# EasyEDA schematic schematic_main_board.json

## Sheets
1 Power supply: TITLE: Power supply; REV: 6.1; Date: 2026-03-01; Sheet: 1/5; Drawn By: Jibril Sharafi; Company: EnergyMe SRL
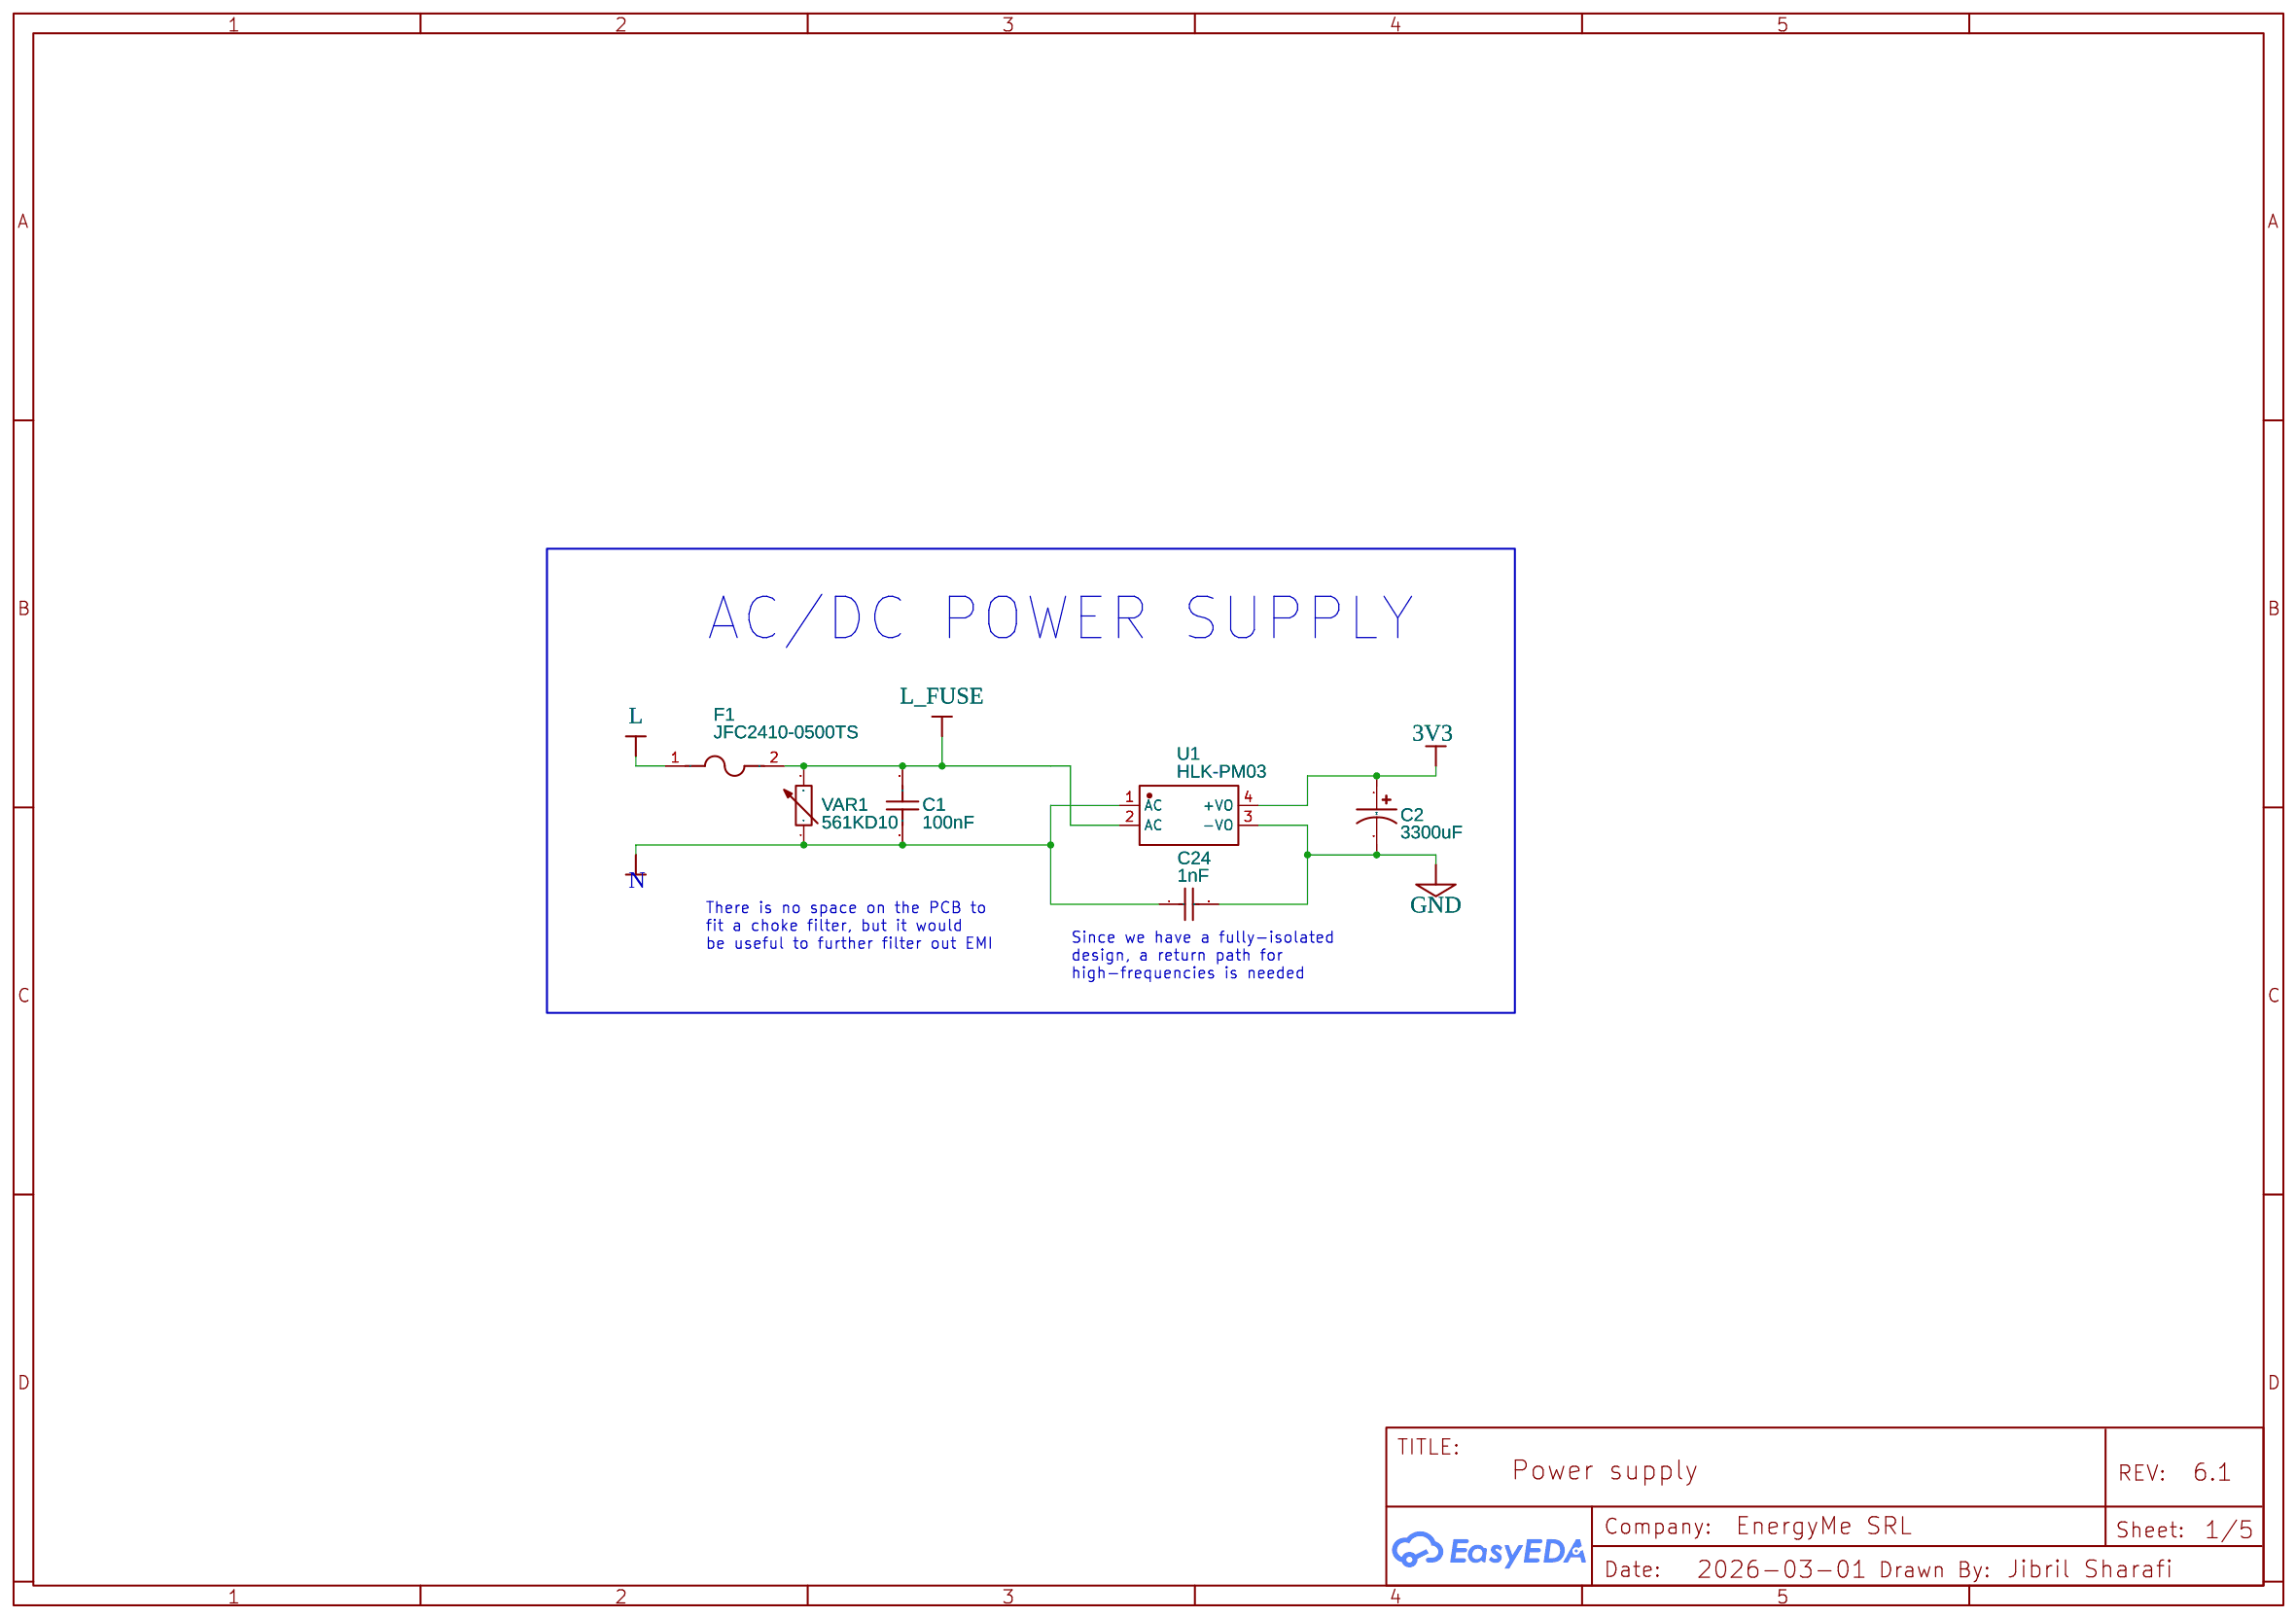
[diagram p0: Power supply]
2 MCU/Multiplexer: TITLE: MCU/Multiplexer; Sheet: 2/5
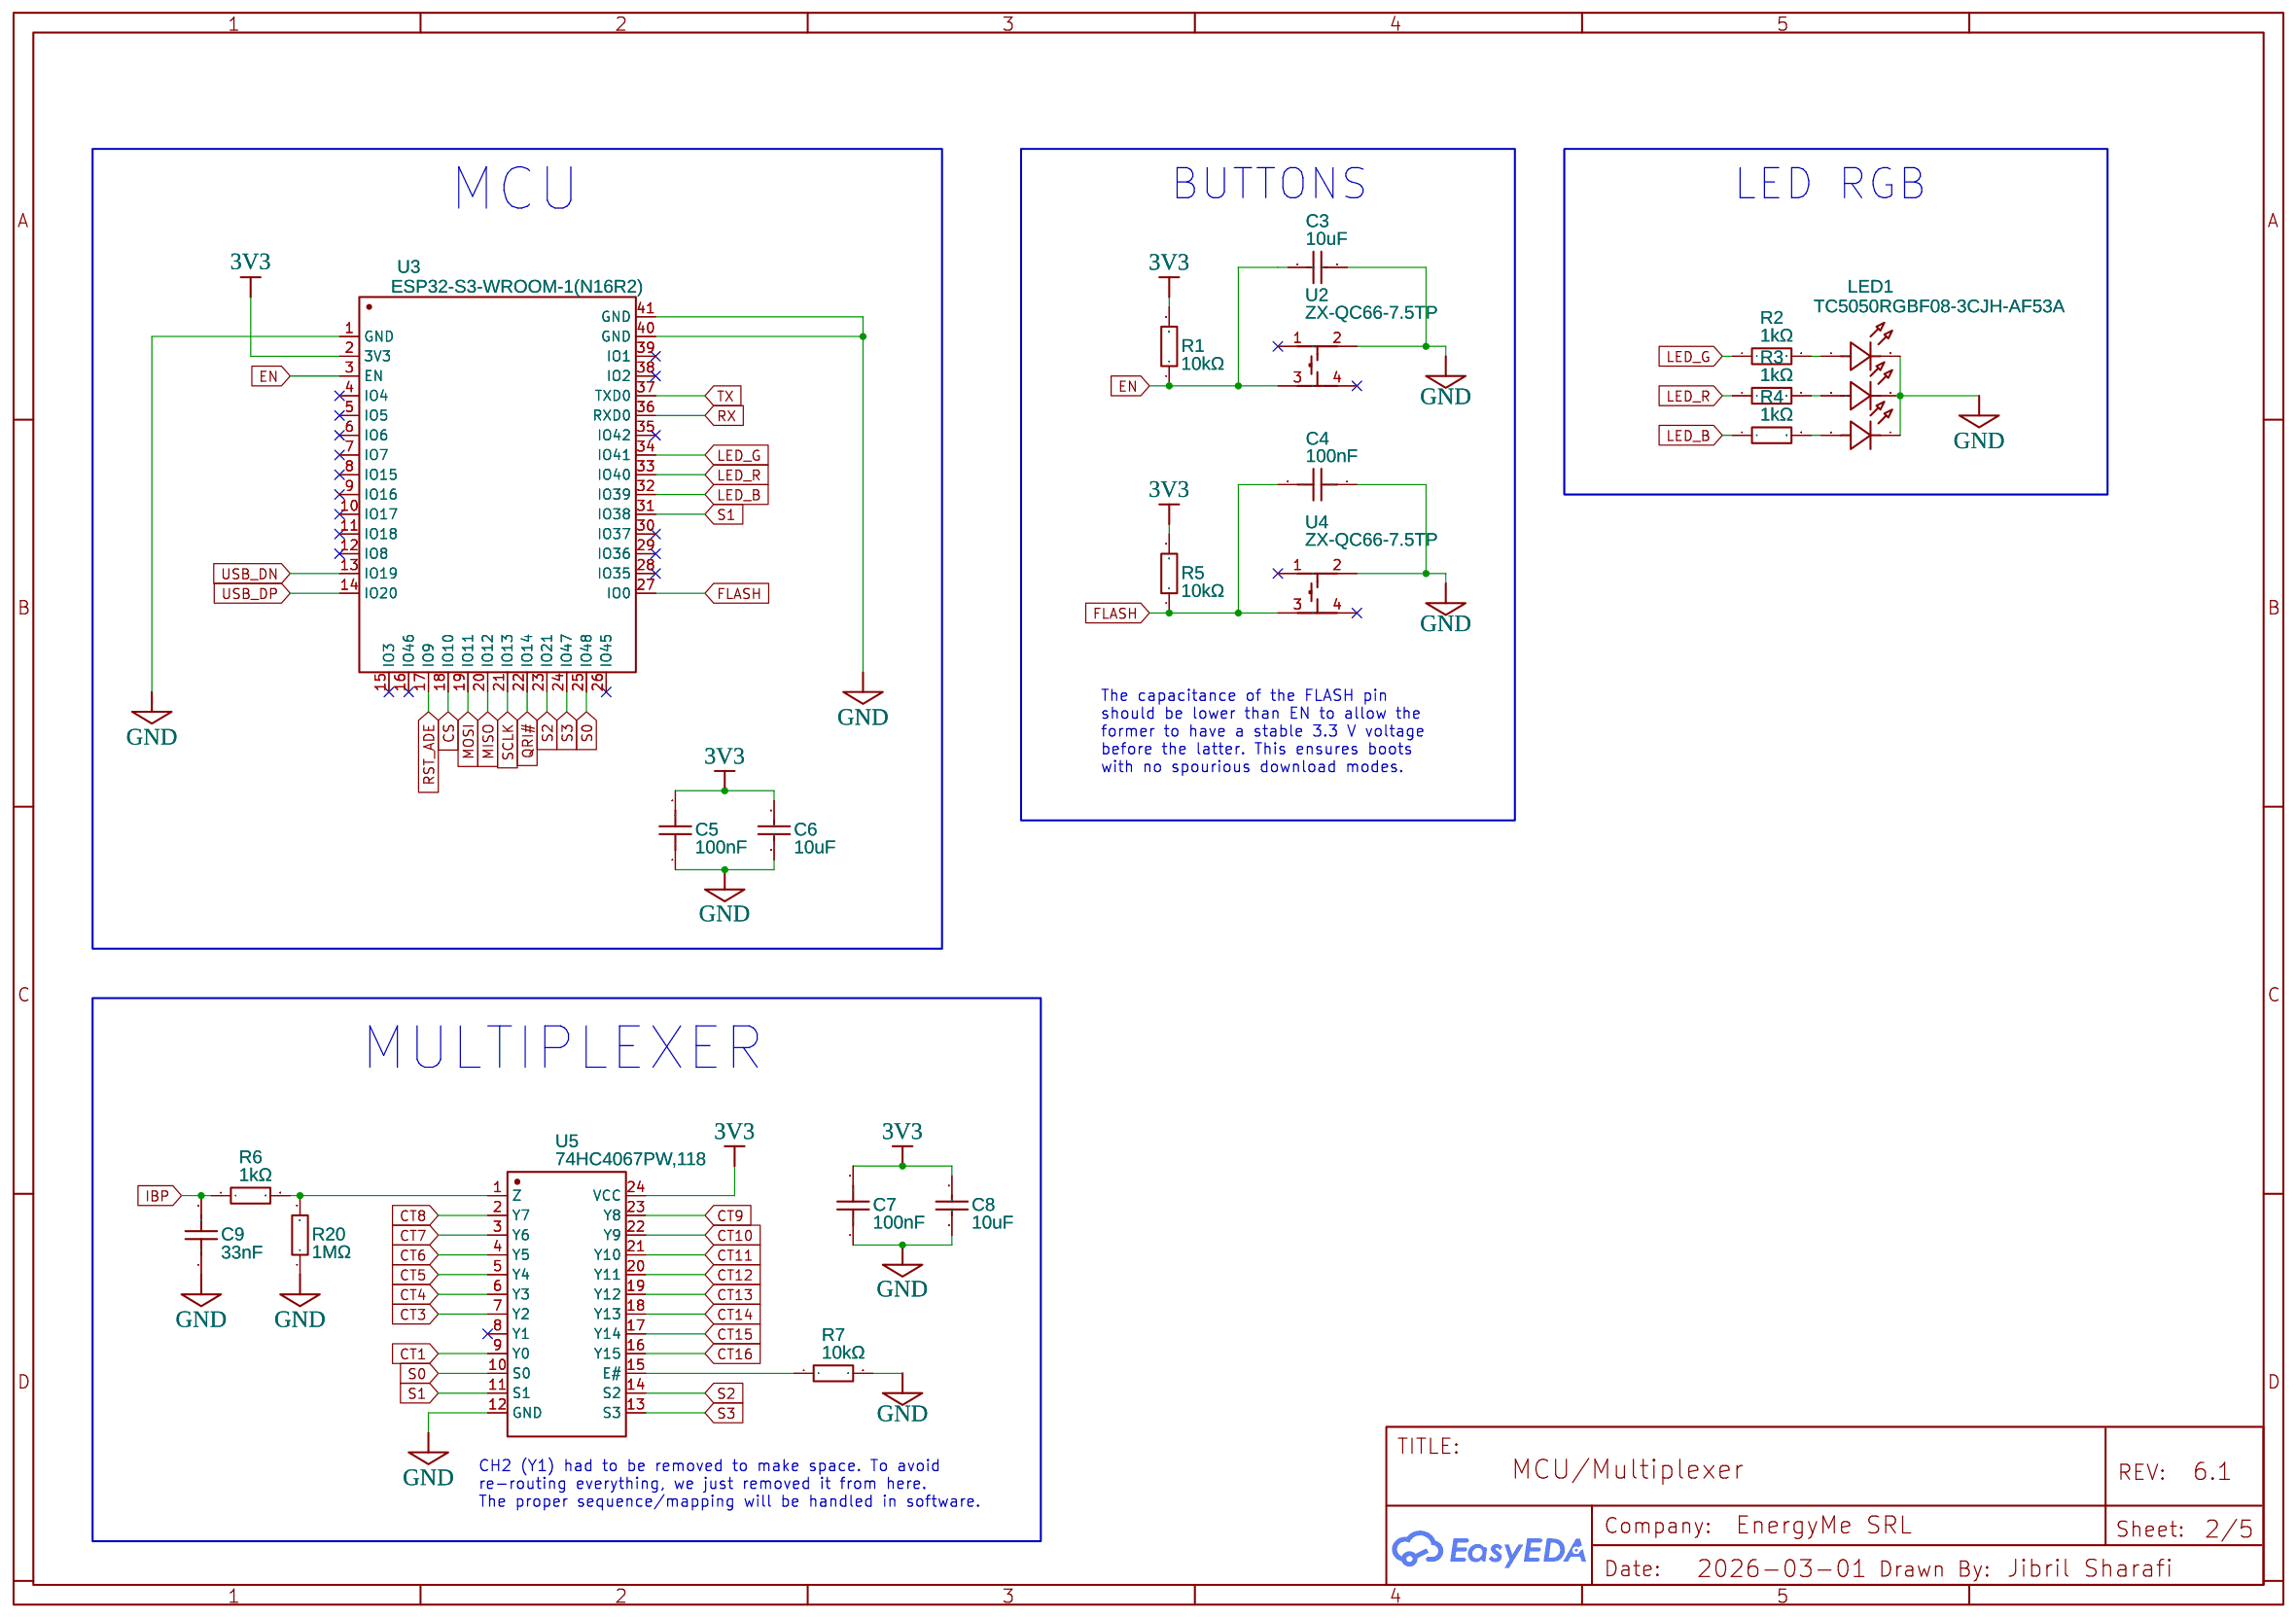
[diagram p1: MCU/Multiplexer]
3 Terminals: TITLE: Terminals; Sheet: 3/5
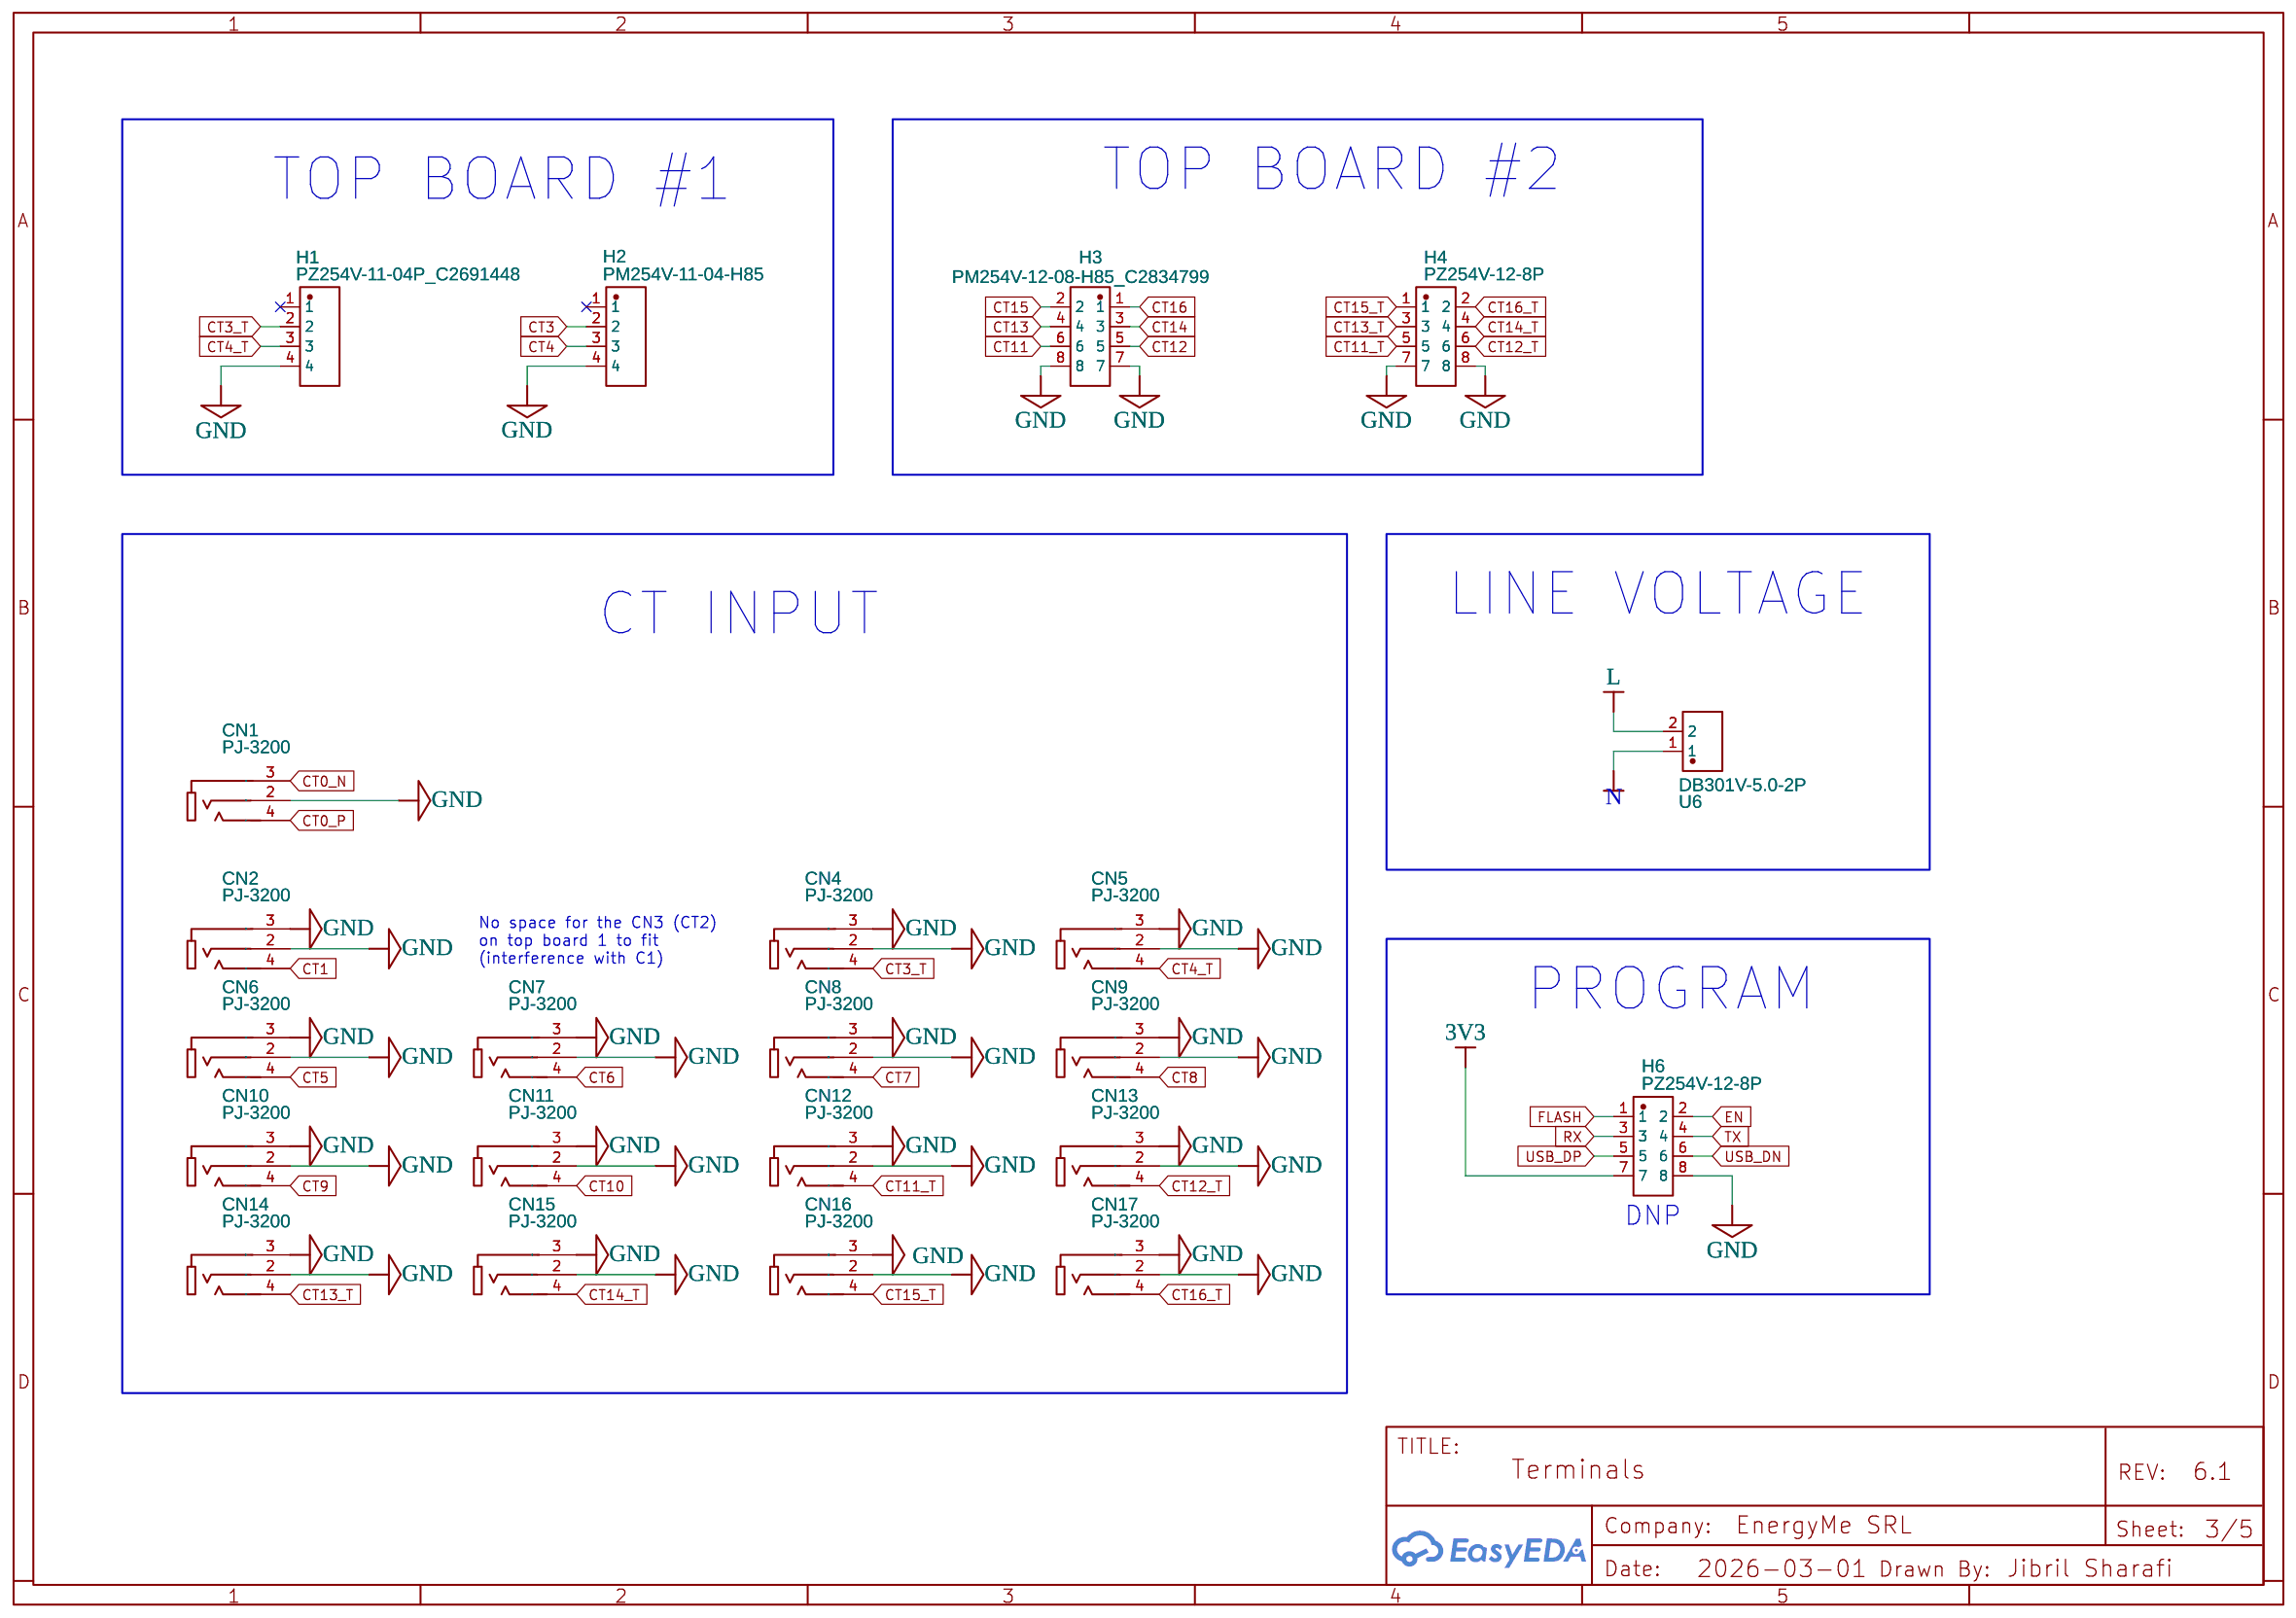
[diagram p2: Terminals]
4 Energy IC: TITLE: Energy IC; Sheet: 4/5
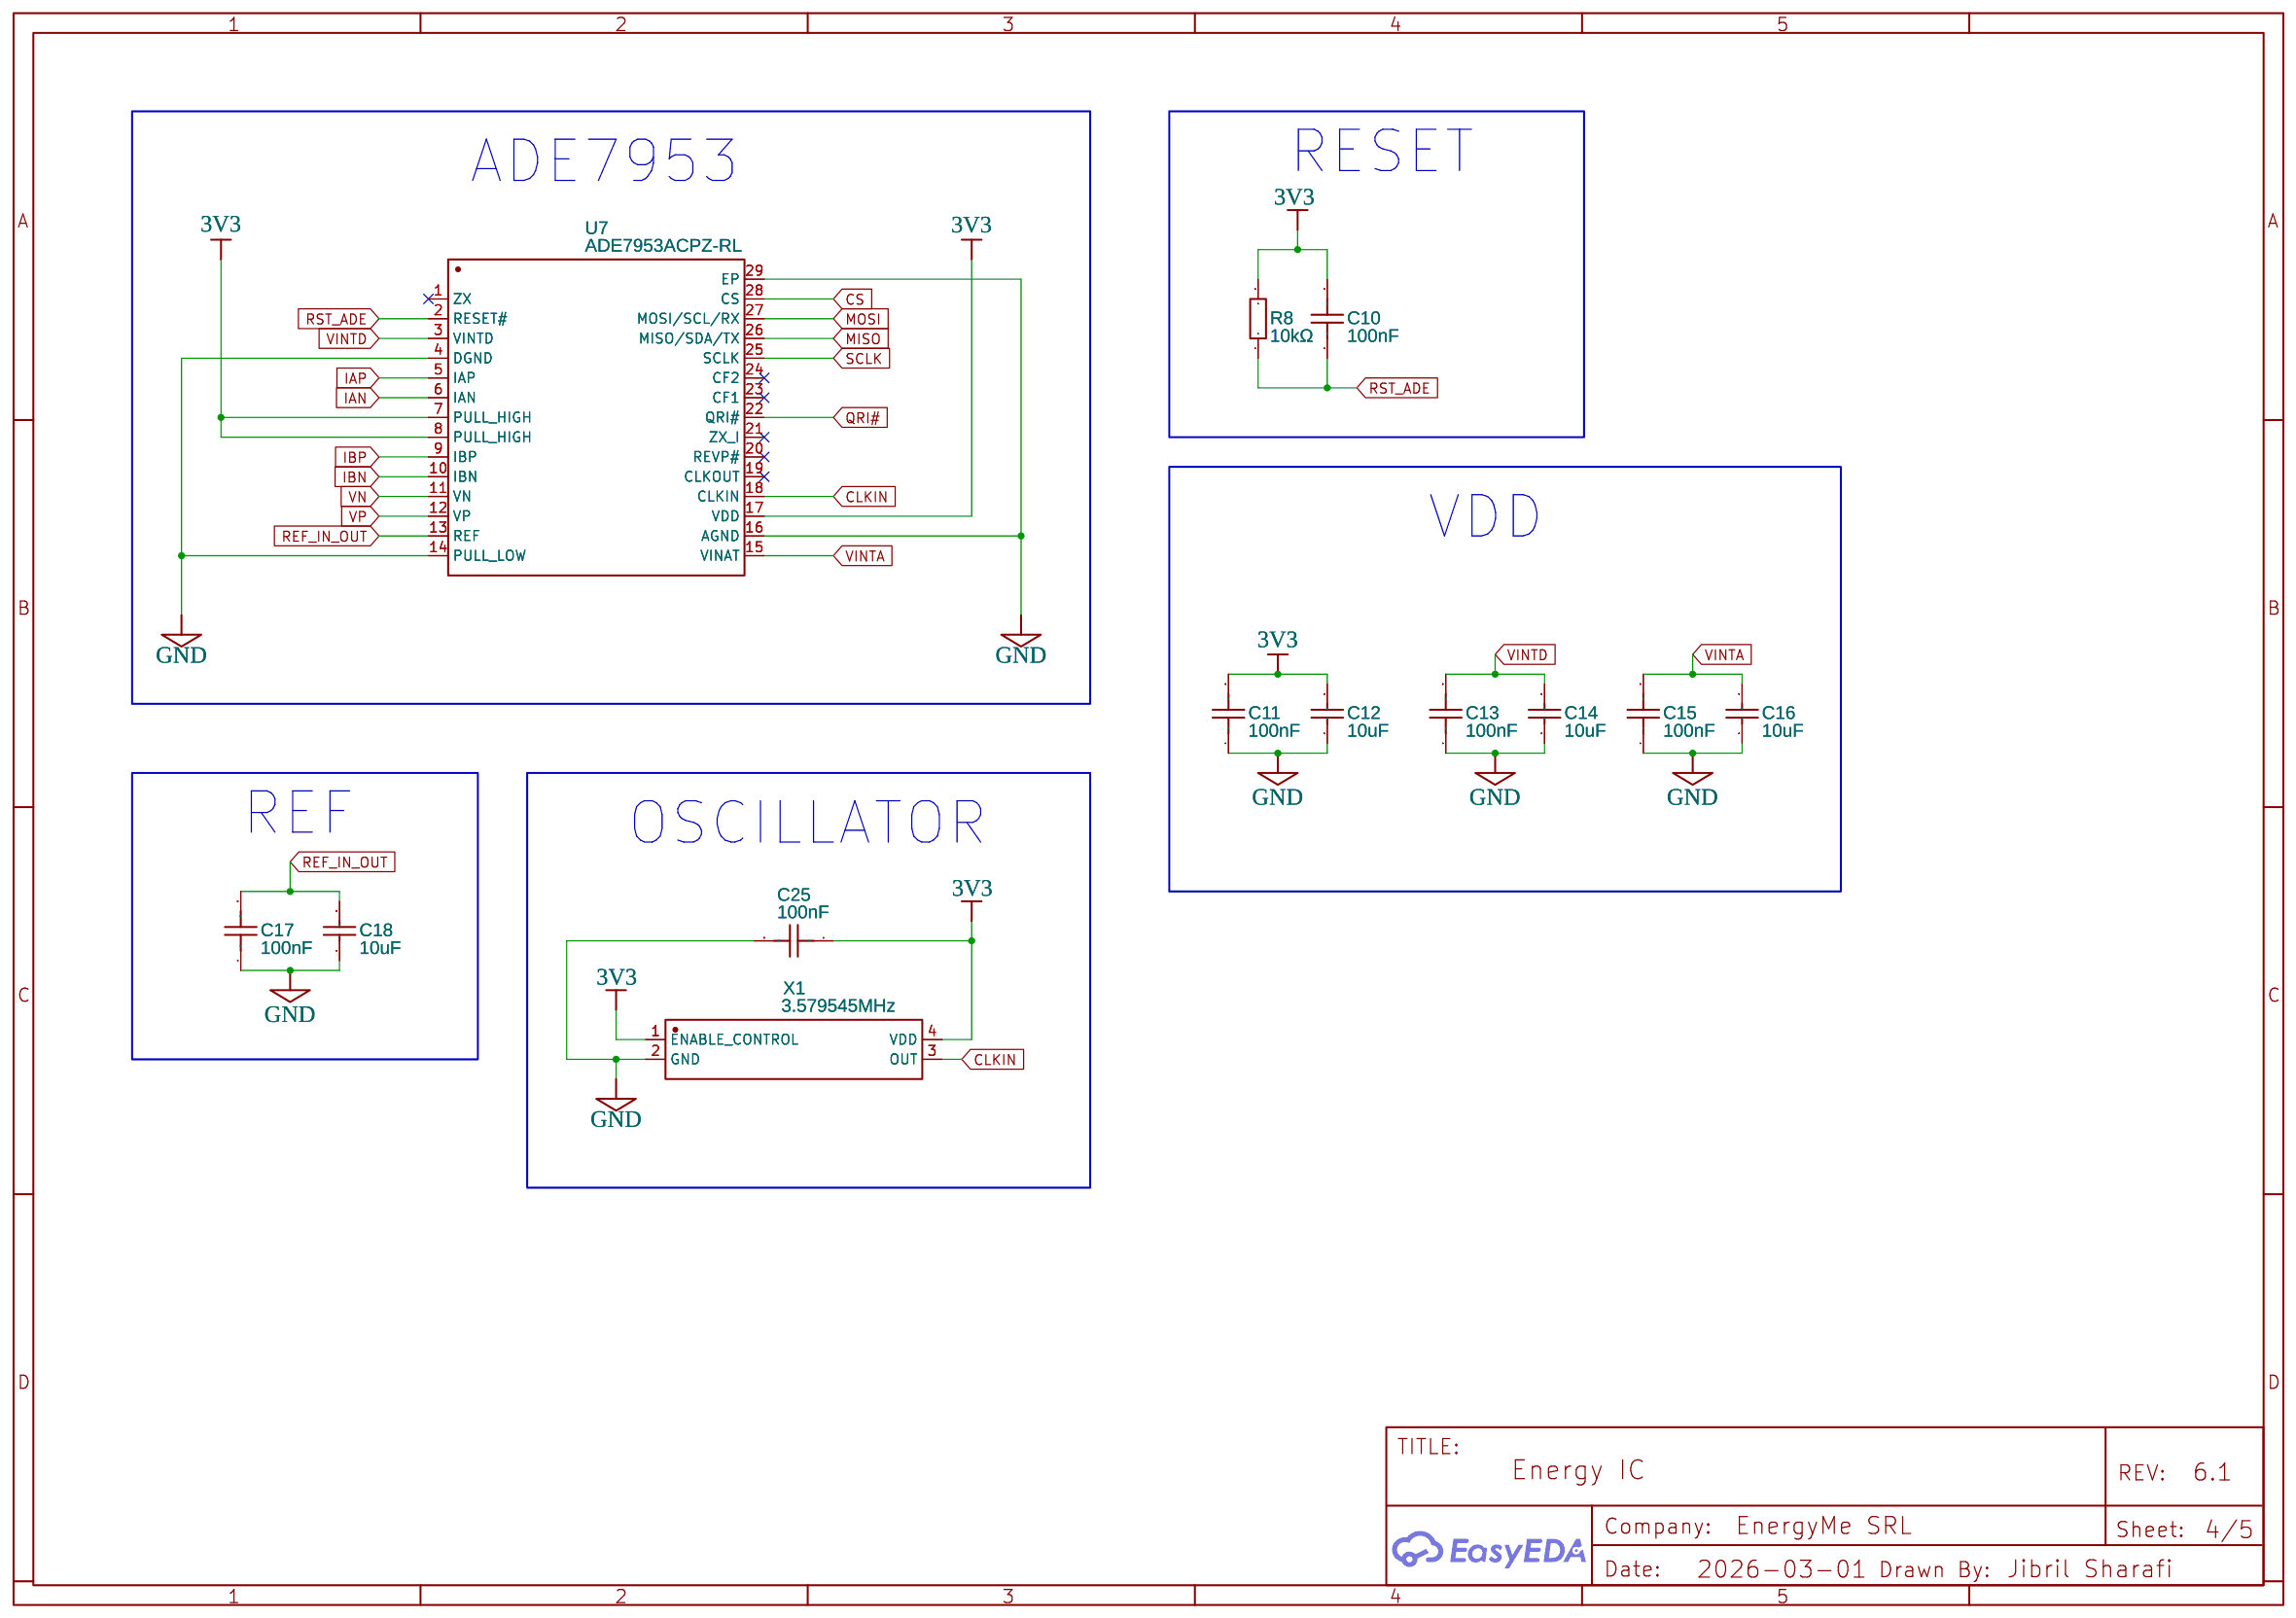
[diagram p3: Energy IC]
5 Sensors: TITLE: Sensors; Sheet: 5/5
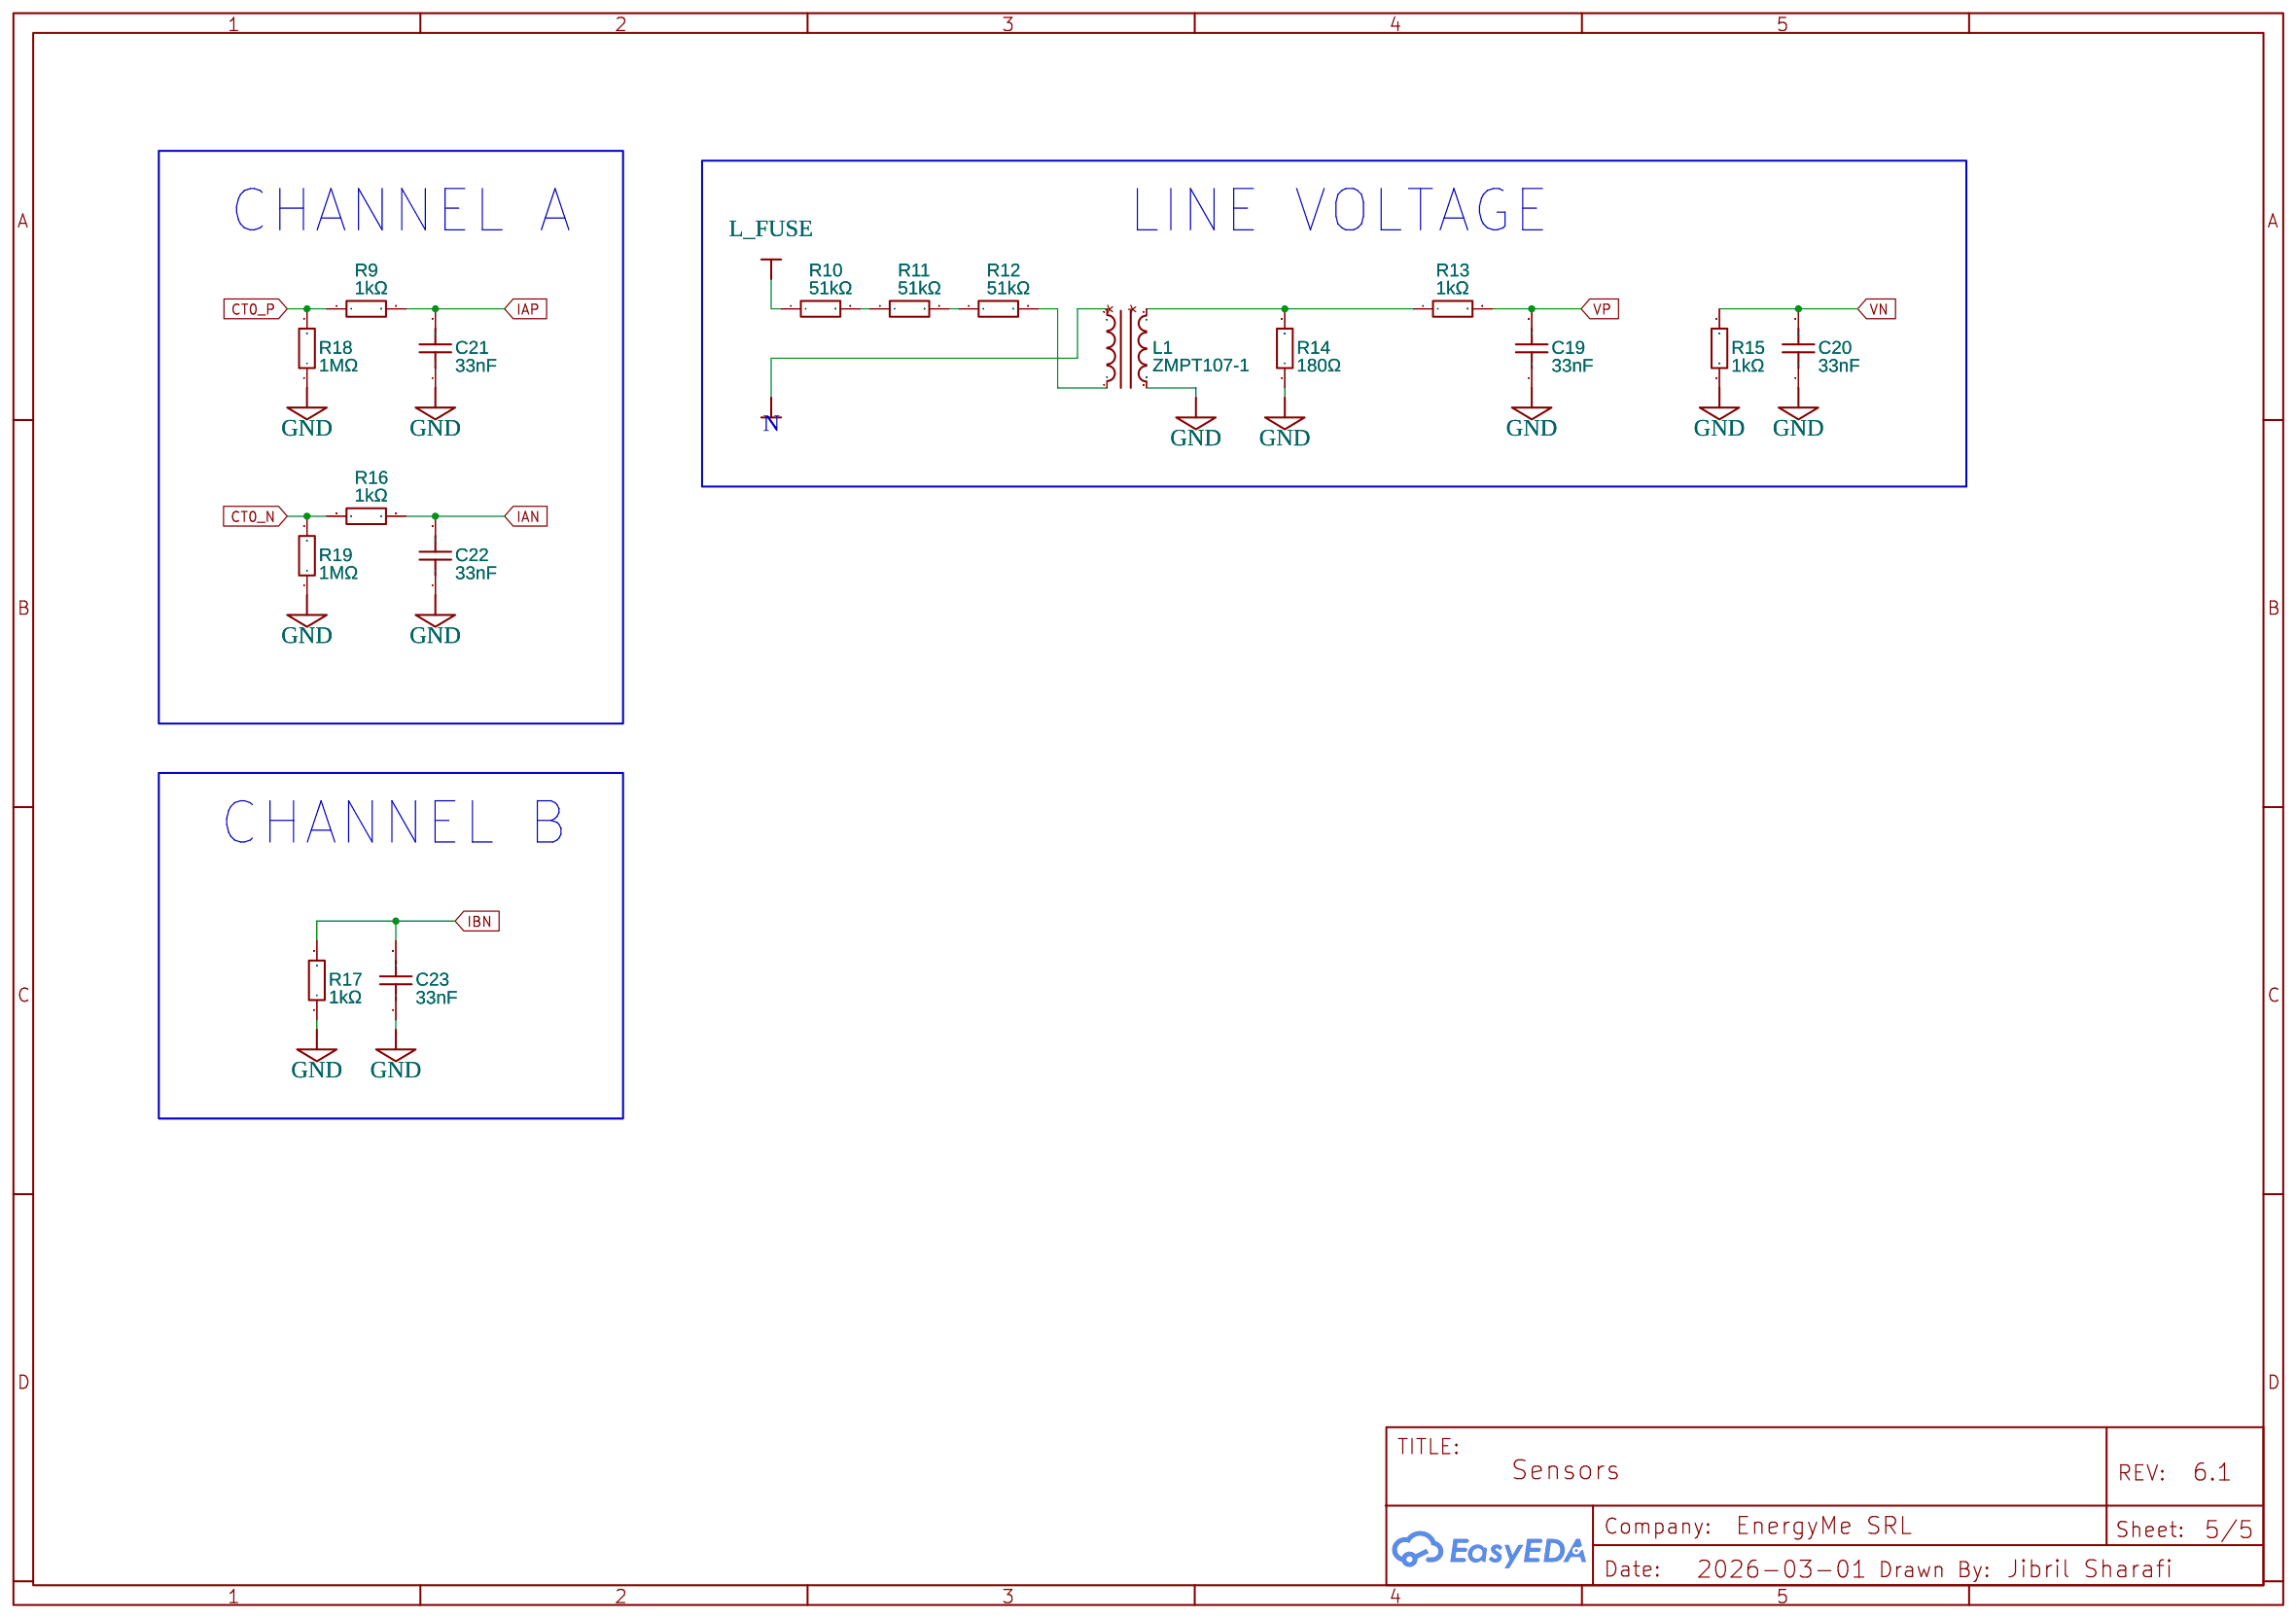
[diagram p4: Sensors]

## Parts
sheet Energy IC
C10  100nF  [C0402]
C11  100nF  [C0402]
C12  10uF  [C0402]
C13  100nF  [C0402]
C14  10uF  [C0402]
C15  100nF  [C0402]
C16  10uF  [C0402]
C17  100nF  [C0402]
C18  10uF  [C0402]
C25  100nF  [C0402]
R8  10kΩ  [R0402]
U7  ADE7953ACPZ-RL  [LFCSP-28_L5.0-W5.0-P0.50-BL-EP]
X1  3.579545MHz  [OSC-SMD_4P-L3.2-W2.5-BL_FT3HNBPK16.0-T1]
sheet MCU/Multiplexer
C3  10uF  [C0402]
C4  100nF  [C0402]
C5  100nF  [C0402]
C6  10uF  [C0402]
C7  100nF  [C0402]
C8  10uF  [C0402]
C9  33nF  [C0402]
LED1  TC5050RGBF08-3CJH-AF53A  [LED-SMD_6P-L5.0-W5.0-TL_TC5050RGBF08]
R1  10kΩ  [R0402]
R2  1kΩ  [R0402]
R3  1kΩ  [R0402]
R4  1kΩ  [R0402]
R5  10kΩ  [R0402]
R6  1kΩ  [R0402]
R7  10kΩ  [R0402]
R20  1MΩ  [R0402]
U2  ZX-QC66-7.5TP  [KEY-SMD_4P-L6.0-W6.0-P4.50-LS8.6]
U3  ESP32-S3-WROOM-1(N16R2)  [WIRELM-SMD_ESP32-S3-WROOM-1]
U4  ZX-QC66-7.5TP  [KEY-SMD_4P-L6.0-W6.0-P4.50-LS8.6]
U5  74HC4067PW,118  [TSSOP-24_L7.8-W4.4-P0.65-LS6.4-BL]
sheet Power supply
C1  100nF  [CAP-TH_L13.0-W6.0-P10.00-D1.0]
C2  3300uF  [CAP-TH_BD8.0-P3.50-D0.6-FD]
C24  1nF  [C2211]
F1  JFC2410-0500TS  [F2410]
U1  HLK-PM03  [PWRM-TH_HLK-PM03]
VAR1  561KD10  [RES-TH_L12.5-W4.8-P7.50-D1.2-S3.40]
sheet Sensors
C19  33nF  [C0402]
C20  33nF  [C0402]
C21  33nF  [C0402]
C22  33nF  [C0402]
C23  33nF  [C0402]
L1  ZMPT107-1  [XFMR-TH_ZMPT107-1]
R9  1kΩ  [R0402]
R10  51kΩ  [R1206]
R11  51kΩ  [R1206]
R12  51kΩ  [R1206]
R13  1kΩ  [R0402]
R14  180Ω  [R0402]
R15  1kΩ  [R0402]
R16  1kΩ  [R0402]
R17  1kΩ  [R0402]
R18  1MΩ  [R0402]
R19  1MΩ  [R0402]
sheet Terminals
CN1  PJ-3200  [AUDIO-TH_PJ-3200]
CN2  PJ-3200  [AUDIO-TH_PJ-3200]
CN4  PJ-3200  [AUDIO-TH_PJ-3200]
CN5  PJ-3200  [AUDIO-TH_PJ-3200]
CN6  PJ-3200  [AUDIO-TH_PJ-3200]
CN7  PJ-3200  [AUDIO-TH_PJ-3200]
CN8  PJ-3200  [AUDIO-TH_PJ-3200]
CN9  PJ-3200  [AUDIO-TH_PJ-3200]
CN10  PJ-3200  [AUDIO-TH_PJ-3200]
CN11  PJ-3200  [AUDIO-TH_PJ-3200]
CN12  PJ-3200  [AUDIO-TH_PJ-3200]
CN13  PJ-3200  [AUDIO-TH_PJ-3200]
CN14  PJ-3200  [AUDIO-TH_PJ-3200]
CN15  PJ-3200  [AUDIO-TH_PJ-3200]
CN16  PJ-3200  [AUDIO-TH_PJ-3200]
CN17  PJ-3200  [AUDIO-TH_PJ-3200]
H1  PZ254V-11-04P_C2691448  [HDR-TH_4P-P2.54-V-M]
H2  PM254V-11-04-H85  [HDR-TH_4P-P2.54-V-F]
H3  PM254V-12-08-H85_C2834799  [HDR-TH_8P-P2.54-V-F-R2-C4-S2.54]
H4  PZ254V-12-8P  [HDR-TH_8P-P2.54-V-M-R2-C4-S2.54]
H6  PZ254V-12-8P  [HDR-TH_8P-P2.54-V-M-R2-C4-S2.54]
U6  DB301V-5.0-2P  [CONN-TH_2P-P5.00_L7.6-W10.0]

## Library data of the parts
C4 C5 C7 C10 C11 C13 C15 C17 C25 = CC0402KRX7R7BB104: Supplier: LCSC; Manufacturer: YAGEO(国巨); Supplier Part: C60474; JLCPCB Part Class: Extended Part
C3 C6 C8 C12 C14 C16 C18 = CL05A106MQ5NUNC: Supplier: LCSC; Manufacturer: SAMSUNG(三星); Supplier Part: C15525; JLCPCB Part Class: Basic Part
R1 R5 R7 R8 = 0402WGF1002TCE: Supplier: LCSC; Manufacturer: UNI-ROYAL(厚声); Supplier Part: C25744; JLCPCB Part Class: Basic Part
U7 = ADE7953ACPZ-RL: Supplier: LCSC; Supplier Part: C515890; Manufacturer: Analog Devices; Contributor: LCSC; JLCPCB Part Class: Extended Part
X1 = RO03579043: Supplier: LCSC; Supplier Part: C7206319; Manufacturer: TROQ(创捷); JLCPCB Part Class: Extended Part; Contributor: lcsc
C9 C19-C23 = FCC0402B333K500AT: Supplier: LCSC; Supplier Part: C7419416; Manufacturer: FOJAN(富捷); JLCPCB Part Class: Extended Part; Contributor: lcsc
LED1 = TC5050RGBF08-3CJH-AF53A: Supplier: LCSC; Supplier Part: C784540; Manufacturer: TCWIN(天成); Contributor: LCSC; JLCPCB Part Class: Extended Part
R2-R4 R6 R9 R13 R15-R17 = 0402WGF1001TCE: Supplier: LCSC; Manufacturer: UNI-ROYAL(厚声); Supplier Part: C11702; JLCPCB Part Class: Basic Part
R18-R20 = 0402WGF1004TCE: Supplier: LCSC; Manufacturer: UNI-ROYAL(厚声); Supplier Part: C26083; JLCPCB Part Class: Basic Part
U2 U4 = ZX-QC66-7.5TP: Supplier: LCSC; Supplier Part: C7470157; Manufacturer: Megastar(兆星); link: https://atta.szlcsc.com/upload/public/pdf/source/20230724/17F4CEFE0A162643ACB441DBA4F7279A.pdf; Contributor: lcsc
U3 = ESP32-S3-WROOM-1(N16R2): Supplier: LCSC; Supplier Part: C2913205; Manufacturer: ESPRESSIF(乐鑫); Manufacturer Part: ESP32-S3-WROOM-1-N16R2; link: https://atta.szlcsc.comnull; Contributor: lcsc; JLCPCB Part Class: Extended Part
U5 = 74HC4067PW,118: Contributor: LCSC; Supplier: LCSC; Manufacturer: Nexperia(安世); Supplier Part: C179326; JLCPCB Part Class: Extended Part; link: https://lcsc.com/eda_search?q=C179326&%26type=1&ref=editor
C1 = MP2104KGC3XLC: Contributor: LCSC; Supplier: LCSC; Supplier Part: C105759; Manufacturer: SRD(圣融达); Manufacturer Part: MP2104K27C3X6LC; JLCPCB Part Class: Extended Part
C2 = HS0J338M0816PC: Contributor: lcsc; Supplier: LCSC; Supplier Part: C5438512; Manufacturer: HONOR(荣誉); JLCPCB Part Class: Extended Part
C24 = GA352QR7GF102KW01L: Supplier: LCSC; Manufacturer: muRata(村田); Supplier Part: C91599; JLCPCB Part Class: Extended Part
F1 = JFC2410-0500TS: Contributor: LCSC; Supplier: LCSC; Manufacturer: JDTfuse(集电通); Supplier Part: C136377; JLCPCB Part Class: Extended Part
U1 = HLK-PM03: Supplier: LCSC; Supplier Part: C209904; Manufacturer: HI-LINK; Contributor: LCSC; JLCPCB Part Class: Extended Part
VAR1 = 561KD10: Supplier: LCSC; Manufacturer: Brightking(君耀电子); Supplier Part: C78349; JLCPCB Part Class: Extended Part
L1 = ZMPT107-1: Supplier: LCSC; Manufacturer: 择明朗熙; Supplier Part: C125191; JLCPCB Part Class: Extended Part
R10-R12 = 1206W4F5102T5E: Supplier: LCSC; Manufacturer: UNI-ROYAL(厚声); Supplier Part: C17992; JLCPCB Part Class: Extended Part
R14 = 0402WGF1800TCE: Supplier: LCSC; Manufacturer: UNI-ROYAL(厚声); Supplier Part: C38941; JLCPCB Part Class: Extended Part
CN1 CN2 CN4-CN17 = PJ-3200: Contributor: LCSC; Supplier: LCSC; Supplier Part: C2689690; Manufacturer: XKB Connection(中国星坤); JLCPCB Part Class: Extended Part
H1 = PZ254V-11-04P_C2691448: Contributor: LCSC; Supplier: LCSC; Supplier Part: C2691448; Manufacturer: XFCN(兴飞); Manufacturer Part: PZ254V-11-04P; JLCPCB Part Class: Extended Part
H2 = PM254V-11-04-H85: Contributor: LCSC; Supplier: LCSC; Supplier Part: C541851; Manufacturer: XFCN(兴飞); JLCPCB Part Class: Extended Part
H3 = PM254V-12-08-H85_C2834799: Contributor: LCSC; Supplier: LCSC; Supplier Part: C2834799; Manufacturer: XFCN(兴飞); Manufacturer Part: PM254V-12-08-H85; JLCPCB Part Class: Extended Part
H4 H6 = PZ254V-12-8P: Contributor: LCSC; Supplier: LCSC; Supplier Part: C492421; Manufacturer: XFCN(兴飞); JLCPCB Part Class: Extended Part
U6 = DB301V-5.0-2P: Supplier: LCSC; Supplier Part: C395882; Manufacturer: DIBO(地博电气); Manufacturer Part: DB301V-5.0-2P-BU-S; Contributor: LCSC; JLCPCB Part Class: Extended Part

## Nets
3V3: C2.1 C5.2 C6.2 C7.2 C8.2 C10.2 C11.2 C12.2 C25.1 H6.7 R1.2 R5.2 R8.2 U1.4(+VO) U3.2(3V3) U5.24(VCC) U7.7(PULL_HIGH) U7.8(PULL_HIGH) U7.17(VDD) X1.1(ENABLE CONTROL) X1.4(VDD)
GND: C2.2 C3.1 C4.1 C5.1 C6.1 C7.1 C8.1 C9.1 C11.1 C12.1 C13.1 C14.1 C15.1 C16.1 C17.1 C18.1 C19.1 C20.1 C21.1 C22.1 C23.1 C24.2 C25.2 CN1.2 CN2.2 CN2.3 CN4.2 CN4.3 CN5.2 CN5.3 CN6.2 CN6.3 CN7.2 CN7.3 CN8.2 CN8.3 CN9.2 CN9.3 CN10.2 CN10.3 CN11.2 CN11.3 CN12.2 CN12.3 CN13.2 CN13.3 CN14.2 CN14.3 CN15.2 CN15.3 CN16.2 CN16.3 CN17.2 CN17.3 H1.4 H2.4 H3.7 H3.8 H4.7 H4.8 H6.8 L1.2 LED1.4(-) LED1.5(-) LED1.6(-) R7.2 R14.1 R15.2 R17.1 R18.1 R19.1 R20.1 U1.3(-VO) U2.2 U3.1(GND) U3.40(GND) U3.41(GND) U4.2 U5.12(GND) U7.4(DGND) U7.14(PULL_LOW) U7.16(AGND) U7.29(EP) X1.2(GND)
VINTA: C15.2 C16.2 U7.15(VINAT)
VINTD: C13.2 C14.2 U7.3(VINTD)
CLKIN: U7.18(CLKIN) X1.3(OUT)
CS: U3.18(IO10) U7.28(CS)
CT0_N: CN1.3 R16.2 R19.2
CT0_P: CN1.4 R9.1 R18.2
CT1: CN2.4 U5.9(Y0)
CT3: H2.2 U5.7(Y2)
CT3_T: CN4.4 H1.2
CT4: H2.3 U5.6(Y3)
CT4_T: CN5.4 H1.3
CT5: CN6.4 U5.5(Y4)
CT6: CN7.4 U5.4(Y5)
CT7: CN8.4 U5.3(Y6)
CT8: CN9.4 U5.2(Y7)
CT9: CN10.4 U5.23(Y8)
CT10: CN11.4 U5.22(Y9)
CT11: H3.6 U5.21(Y10)
CT11_T: CN12.4 H4.5
CT12: H3.5 U5.20(Y11)
CT12_T: CN13.4 H4.6
CT13: H3.4 U5.19(Y12)
CT13_T: CN14.4 H4.3
CT14: H3.3 U5.18(Y13)
CT14_T: CN15.4 H4.4
CT15: H3.2 U5.17(Y14)
CT15_T: CN16.4 H4.1
CT16: H3.1 U5.16(Y15)
CT16_T: CN17.4 H4.2
EN: C3.2 H6.2 R1.1 U2.3 U3.3(EN)
FLASH: C4.2 H6.1 R5.1 U3.27(IO0) U4.3
IAN: C22.2 R16.1 U7.6(IAN)
IAP: C21.2 R9.2 U7.5(IAP)
IBN: C23.2 R17.2 U7.10(IBN)
IBP: C9.2 R6.1 U7.9(IBP)
L: F1.1 U6.2
L_FUSE: C1.1 F1.2 R10.1 U1.2(AC) VAR1.2
LED_B: R4.1 U3.32(IO39)
LED_G: R2.1 U3.34(IO41)
LED_R: R3.1 U3.33(IO40)
MISO: U3.20(IO12) U7.26(MISO/SDA/TX)
MOSI: U3.19(IO11) U7.27(MOSI/SCL/RX)
N: C1.2 C24.1 L1.3 U1.1(AC) U6.1 VAR1.1
QRI#: U3.22(IO14) U7.22(QRI#)
REF_IN_OUT: C17.2 C18.2 U7.13(REF)
RST_ADE: C10.1 R8.1 U3.17(IO9) U7.2(RESET#)
RX: H6.3 U3.36(RXD0)
S0: U3.25(IO48) U5.10(S0)
S1: U3.31(IO38) U5.11(S1)
S2: U3.23(IO21) U5.14(S2)
S3: U3.24(IO47) U5.13(S3)
SCLK: U3.21(IO13) U7.25(SCLK)
TX: H6.4 U3.37(TXD0)
USB_DN: H6.6 U3.13(IO19)
USB_DP: H6.5 U3.14(IO20)
VN: C20.2 R15.1 U7.11(VN)
VP: C19.2 R13.2 U7.12(VP)
Net-(L1-1): L1.1 R13.1 R14.2
Net-(L1-4): L1.4 R12.2
Net-(LED1-1): LED1.1(+) R2.2
Net-(LED1-2): LED1.2(+) R3.2
Net-(LED1-3): LED1.3(+) R4.2
Net-(R6-2): R6.2 R20.2 U5.1(Z)
Net-(R7-1): R7.1 U5.15(E#)
Net-(R10-2): R10.2 R11.1
Net-(R11-2): R11.2 R12.1

Not connected (* = marked no-connect by the designer): H1 1*; H2 1*; U2 1* 4*; U3 4(IO4)* 5(IO5)* 6(IO6)* 7(IO7)* 8(IO15)* 9(IO16)* 10(IO17)* 11(IO18)* 12(IO8)* 15(IO3)* 16(IO46)* 26(IO45)* 28(IO35)* 29(IO36)* 30(IO37)* 35(IO42)* 38(IO2)* 39(IO1)*; U4 1* 4*; U5 8(Y1)*; U7 1(ZX)* 19(CLKOUT)* 20(REVP#)* 21(ZX_I)* 23(CF1)* 24(CF2)*

## Notes on the sheets
sheet 1
- AC/DC POWER SUPPLY
- There is no space on the PCB to
  fit a choke filter, but it would
  be useful to further filter out EMI
- Since we have a fully-isolated
  design, a return path for
  high-frequencies is needed
sheet 2
- MCU
- BUTTONS
- LED RGB
- The capacitance of the FLASH pin
  should be lower than EN to allow the
  former to have a stable 3.3 V voltage
  before the latter. This ensures boots
  with no spourious download modes.
- MULTIPLEXER
- CH2 (Y1) had to be removed to make space. To avoid
  re-routing everything, we just removed it from here.
  The proper sequence/mapping will be handled in software.
sheet 3
- TOP BOARD #1
- TOP BOARD #2
- LINE VOLTAGE
- CT INPUT
- No space for the CN3 (CT2)
  on top board 1 to fit
  (interference with C1)
- PROGRAM
- DNP
sheet 4
- ADE7953
- RESET
- VDD
- REF
- OSCILLATOR
sheet 5
- CHANNEL A
- LINE VOLTAGE
- CHANNEL B
